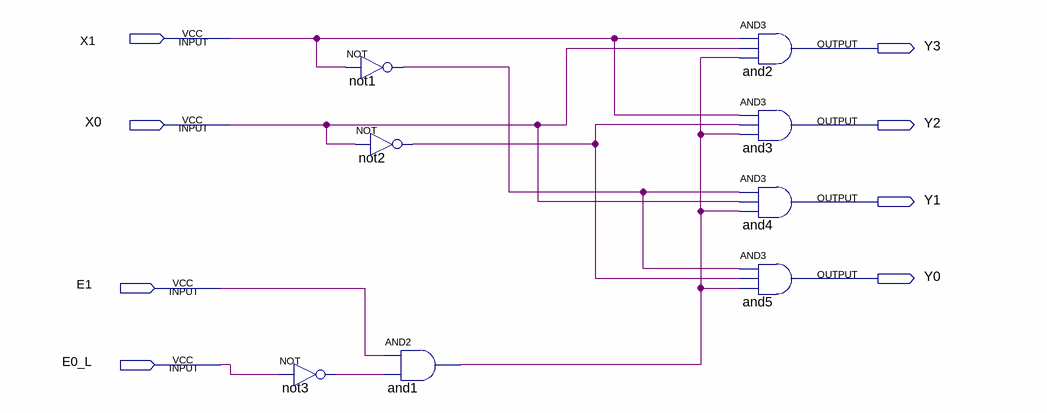
[diagram p0: schematic sheet]
// Quartus schematic Dec2_4.bdf as structural Verilog: 8 symbols, 8 pins
module Dec2_4 (
  input  X1,
  input  X0,
  input  E1,
  input  E0_L,
  output Y3,
  output Y2,
  output Y1,
  output Y0
);

  wire and1_out, not1_out, not2_out, not3_out;

  not not3 (not3_out, E0_L);
  not not1 (not1_out, X1);
  not not2 (not2_out, X0);
  and and1 (and1_out, E1, not3_out);
  and and2 (Y3, X1, X0, and1_out);
  and and3 (Y2, X1, not2_out, and1_out);
  and and4 (Y1, not1_out, X0, and1_out);
  and and5 (Y0, not1_out, not2_out, and1_out);
endmodule
